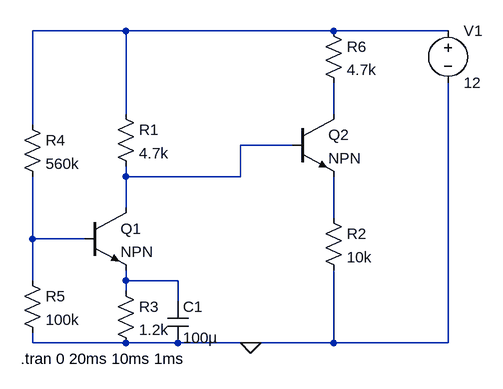
[diagram p0: schematic Draft1.asc]
Draft1.asc, the LTspice schematic file:
Version 4
SHEET 1 880 680
WIRE 48 -112 -96 -112
WIRE 368 -112 48 -112
WIRE 544 -112 368 -112
WIRE 48 16 48 -112
WIRE 368 16 368 -32
WIRE -96 32 -96 -112
WIRE 304 64 224 64
WIRE 48 112 48 96
WIRE 224 112 224 64
WIRE 224 112 48 112
WIRE 48 160 48 112
WIRE 368 176 368 112
WIRE -96 208 -96 112
WIRE -16 208 -96 208
WIRE -96 272 -96 208
WIRE 48 272 48 256
WIRE 128 272 48 272
WIRE 48 288 48 272
WIRE 128 304 128 272
WIRE -96 368 -96 352
WIRE 48 368 -96 368
WIRE 128 368 48 368
WIRE 240 368 128 368
WIRE 368 368 368 256
WIRE 368 368 240 368
WIRE 544 368 544 -32
WIRE 544 368 368 368
FLAG 240 368 0
SYMBOL npn -16 160 R0
SYMATTR InstName Q1
SYMBOL npn 304 16 R0
SYMATTR InstName Q2
SYMBOL res 32 0 R0
SYMATTR InstName R1
SYMATTR Value 4.7k
SYMBOL res 352 160 R0
SYMATTR InstName R2
SYMATTR Value 10k
SYMBOL res 32 272 R0
SYMATTR InstName R3
SYMATTR Value 1.2k
SYMBOL res -112 16 R0
SYMATTR InstName R4
SYMATTR Value 560k
SYMBOL res -112 256 R0
SYMATTR InstName R5
SYMATTR Value 100k
SYMBOL res 352 -128 R0
SYMATTR InstName R6
SYMATTR Value 4.7k
SYMBOL cap 112 304 R0
SYMATTR InstName C1
SYMATTR Value 100µ
SYMBOL voltage 544 -128 R0
SYMATTR InstName V1
SYMATTR Value 12
TEXT -114 392 Left 2 !.tran 0 20ms 10ms 1ms

The netlist it stands for:
* Draft1.asc
Q1 N003 N005 N006 0 NPN
Q2 N002 N003 N004 0 NPN
R1 N001 N003 4.7k
R2 N004 0 10k
R3 N006 0 1.2k
R4 N001 N005 560k
R5 N005 0 100k
R6 N001 N002 4.7k
C1 N006 0 100µ
V1 N001 0 12
.model NPN NPN
.model PNP PNP
.lib standard.bjt
.tran 0 20ms 10ms 1ms
.backanno
.end